# EAGLE design Button-Board (EAGLE 9.1.1)
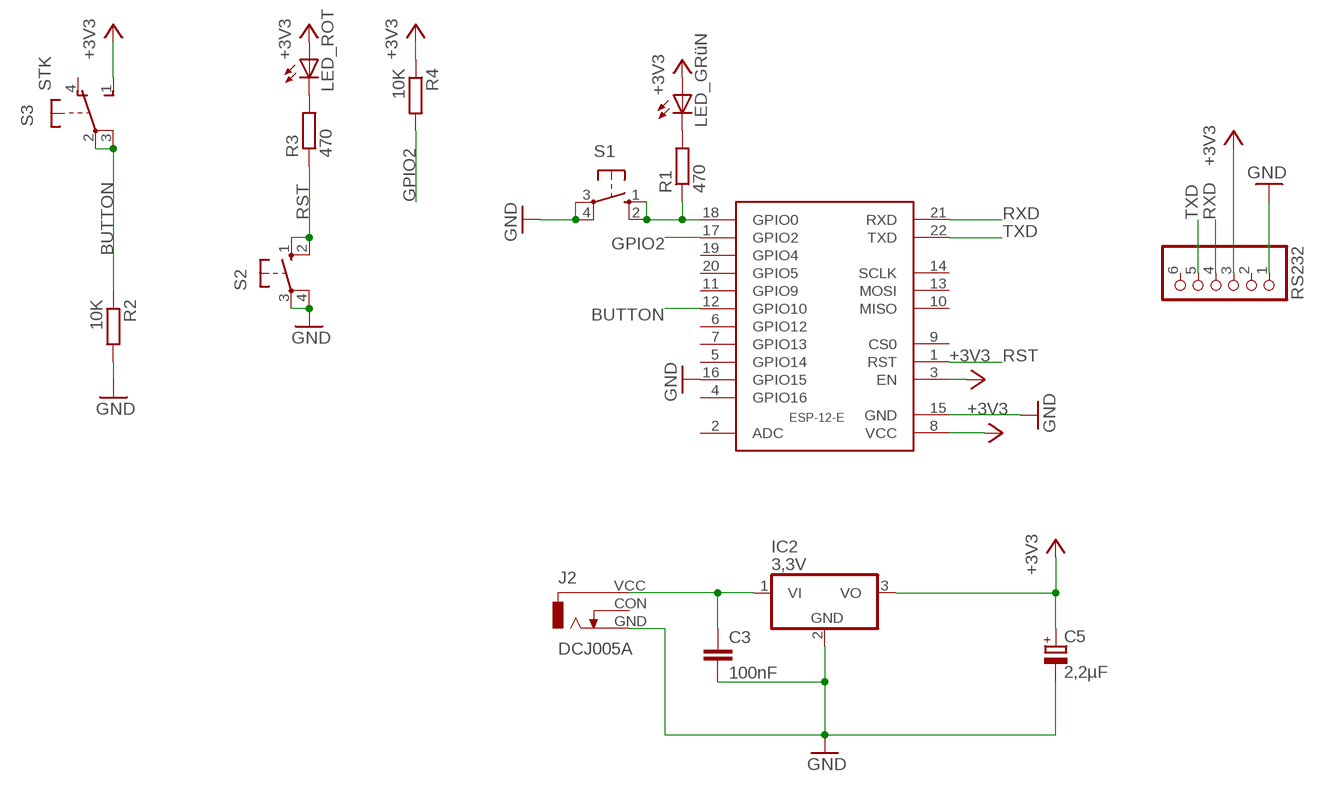
[diagram p0: schematic, sheet 1]

## Parts
C3  100nF  C-EU050-030X075  [C050-030X075]
C5  2,2µF  CPOL-EUE2.5-6  [E2,5-6]
IC2  3,3V  7805TV  [TO220V]
J2  DCJ005A  [DC005A]
LED_GRüN  LED5MM  [LED5MM]
LED_ROT  LED5MM  [LED5MM]
R1  470  R-EU_0207/10  [0207/10]
R2  10K  R-EU_0207/10  [0207/10]
R3  470  R-EU_0207/10  [0207/10]
R4  10K  R-EU_0207/10  [0207/10]
RS232  PINHD-1X6  [1X06]
S1  10-XX  [B3F-10XX]
S2  10-XX  [B3F-10XX]
S3  STK  [STK]
U$1  ESP-12-E  [ESP-12-E]

## Nets
+3V3 [supply]: C5.+ IC2.3(VO) LED_GRüN.A LED_ROT.A R4.1 RS232.3 S3.1(S) U$1.3(EN) U$1.8(VCC)
BUTTON: R2.1 S3.2(P) S3.3(P) U$1.12(GPIO10)
GND [supply]: C3.2 C5.- IC2.2(GND) J2.GND R2.2 RS232.1 S1.3(P) S1.4(P1) S2.3(P) S2.4(P1) U$1.15(GND) U$1.16(GPIO15)
GPIO2: R4.2 U$1.17(GPIO2)
N$1: R1.1 S1.1(S) S1.2(S1) U$1.18(GPIO0)
N$2: C3.1 IC2.1(VI) J2.VCC
N$3: LED_GRüN.K(C) R1.2
N$4: LED_ROT.K(C) R3.2
RST: R3.1 S2.1(S) S2.2(S1) U$1.1(RST)
RXD: RS232.4 U$1.21(RXD)
TXD: RS232.5 U$1.22(TXD)
Unconnected: J2.CON RS232.2 RS232.6 S3.4(O) U$1.2(ADC) U$1.4(GPIO16) U$1.5(GPIO14) U$1.6(GPIO12) U$1.7(GPIO13) U$1.9(CS0) U$1.10(MISO) U$1.11(GPIO9) U$1.13(MOSI) U$1.14(SCLK) U$1.19(GPIO4) U$1.20(GPIO5)

## Library data of the parts
C3 = rcl:C-EU: CAPACITOR, European symbol
C5 = rcl:CPOL-EU: POLARIZED CAPACITOR, European symbol
IC2 = linear:78*: Positive VOLTAGE REGULATOR Source: http://cache.national.com/ds/LM/LM78L05.pdf http://www.fairchildsemi.com/ds/LM/LM7805.pdf
J2 = !Häufige Bauteile:DCJ005A: DC POWER JACK Source: DCJ0202.pdf; OC_FARNELL: unknown; OC_NEWARK: unknown
LED_GRüN LED_ROT = !Häufige Bauteile:LED5MM
R1-R4 = rcl:R-EU_: RESISTOR, European symbol
RS232 = pinhead:PINHD-1X6: PIN HEADER
S1 S2 = switch-omron:10-XX: OMRON SWITCH; MPN: B3F-1000; OC_FARNELL: 176432; OC_NEWARK: 36M3542
S3 = switch-misc:STK: SWITCH
U$1 = !Eigene Library SMD:ESP-12-E

## Net classes
0 default: width 0.254 mm, clearance 0.254 mm
1 supply: width 0.508 mm, clearance 0.508 mm

## Board
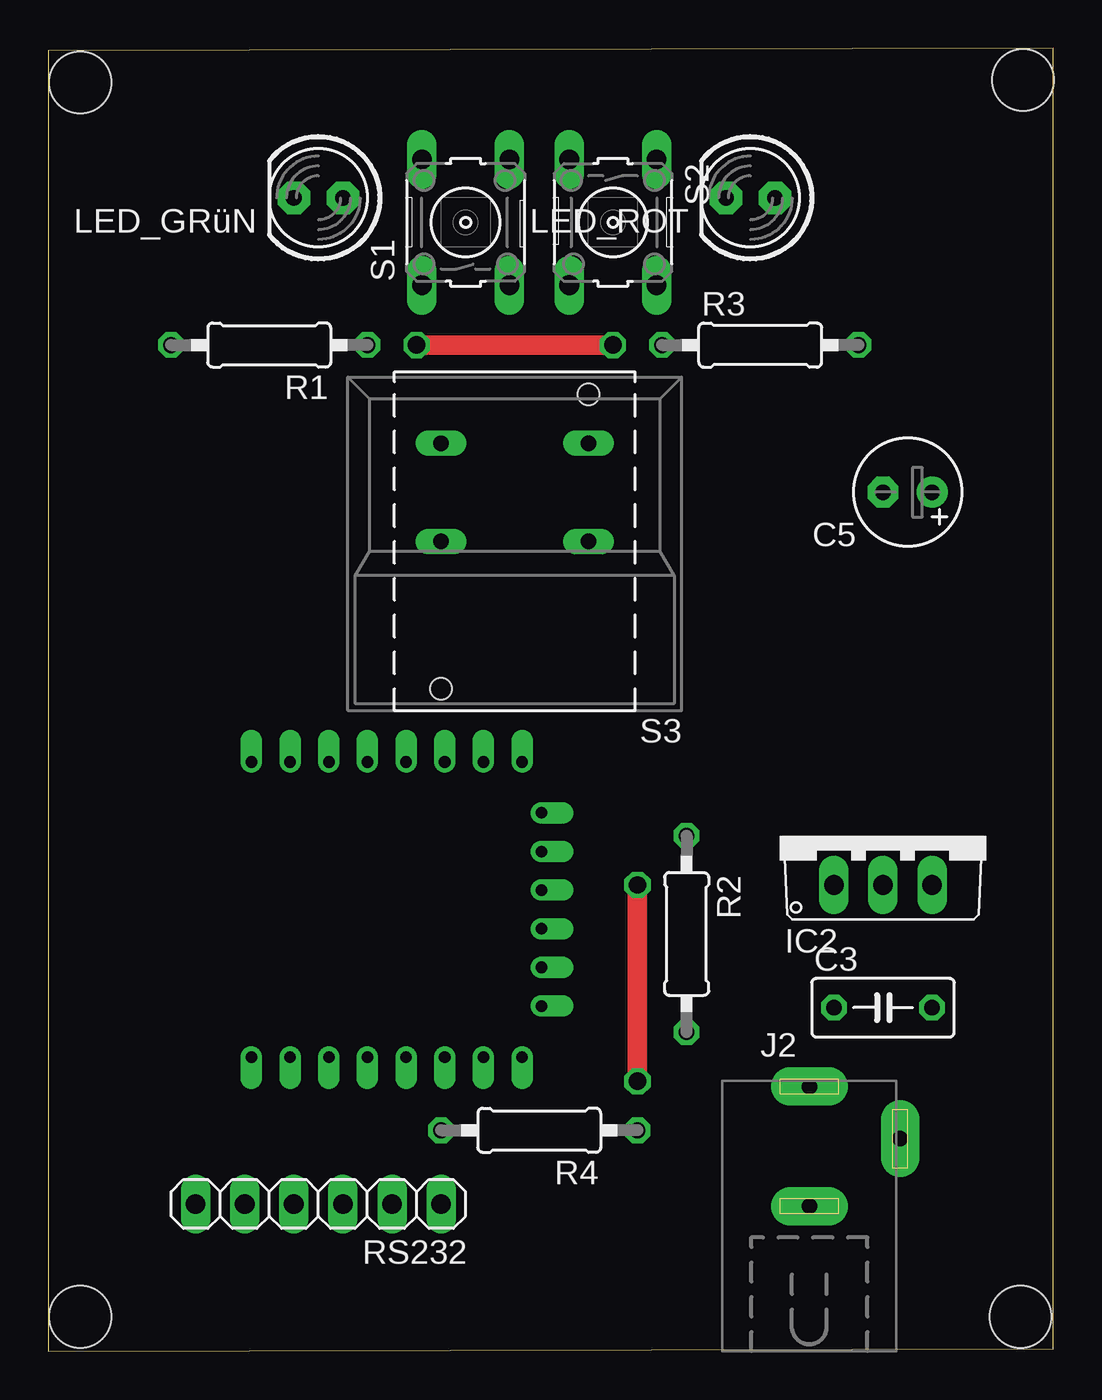
[diagram p1: board, top side]
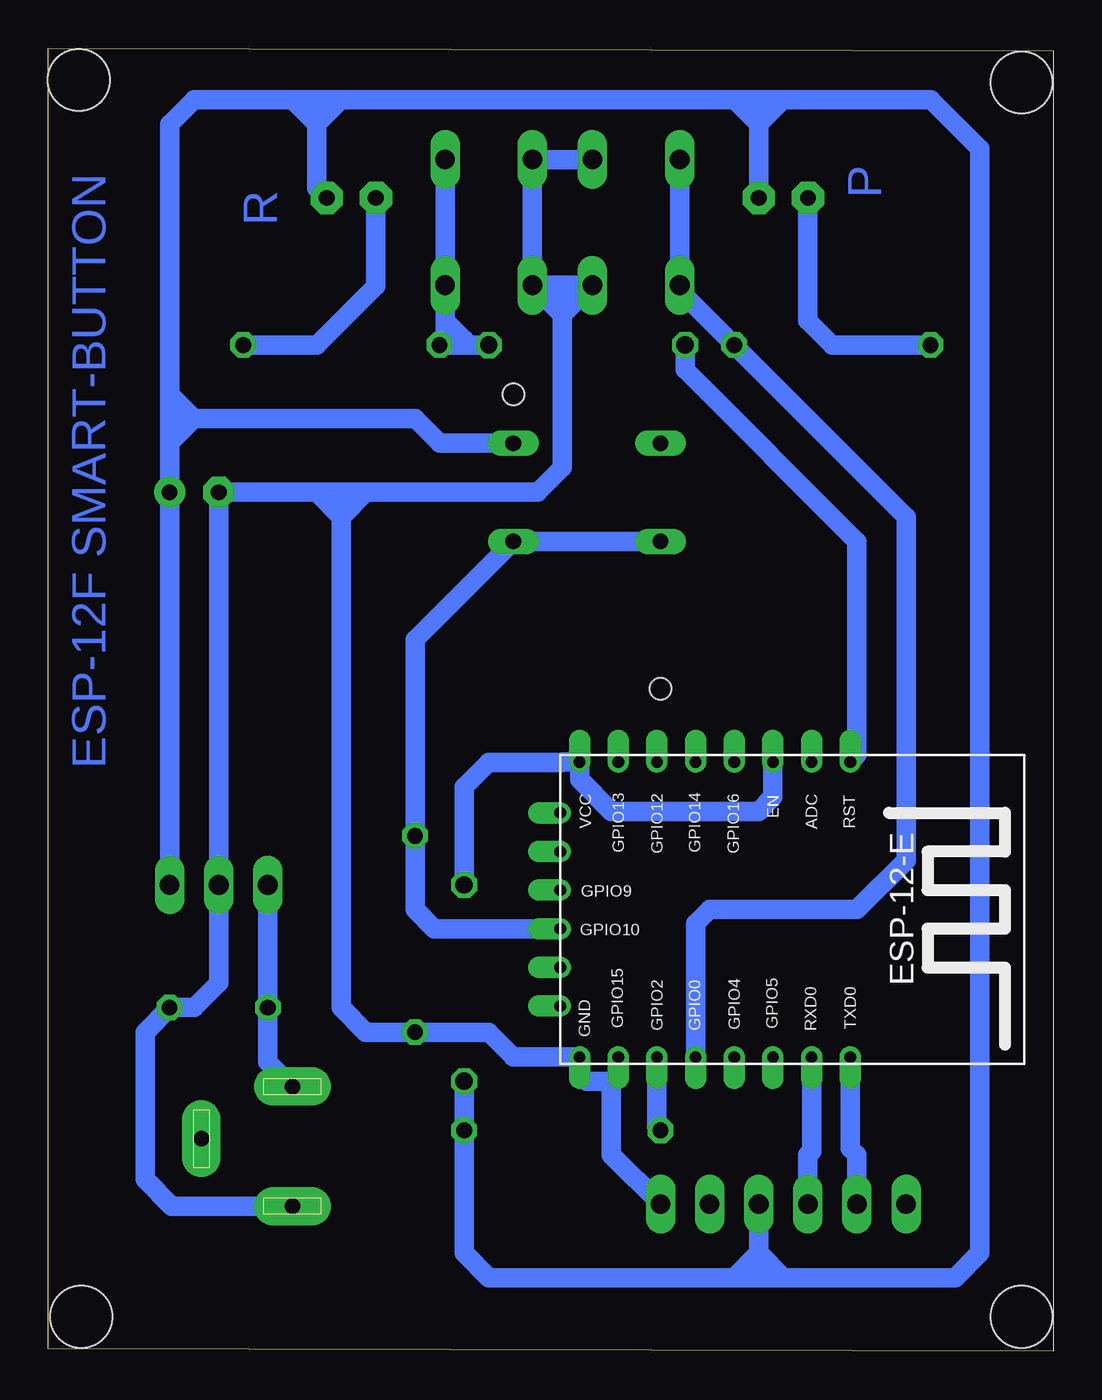
[diagram p2: board, bottom side, seen from below]

Size 51.99 x 67.43 mm. Coordinates in mm from the lower left corner, seen from the top.
Outline: 0,0 51.99,0.13 51.99,67.43 0,67.3 0,0
Copper layers (1*16): Top 0.035mm / dielectric 1.5mm / Bottom 0.035mm
Design rules "platinenbelichter": minimum track width 10mil, minimum drill 24mil, track to track 10mil, track to pad 10mil, pad to pad 10mil, via to via 10mil, smd to smd 10mil, copper to edge 40mil, drill to drill 8mil, minimum pad ring 10mil, minimum via ring 8mil, stop-mask expansion 10mil, vias tented up to drill 0mil, thermal gap 10mil
Holes 3.2 mm at 1.65,1.78 50.29,1.78 1.65,65.66 50.42,65.79

### Footprints (pad centres in the part's own frame; a part is rotated, then mirrored left to right if it is on the bottom)
C050-030X075 = drill 0.813 octagon: 1 -2.54,0; 2 2.54,0
E2,5-6 = drill 0.813 pad 1.6: + -1.27,0 | drill 0.813 pad 1.6 octagon: - 1.27,0
TO220V = drill 1.016 long: 1 -2.54,-2.54; 2 0,-2.54; 3 2.54,-2.54
DC005A = drill 0.8 pad 2 long: CON 4.7,4.65; GND 0,1.15; VCC 0,7.35
LED5MM = drill 0.813 pad 1.676 octagon: A -1.27,0; K 1.27,0
0207/10 = drill 0.813 octagon: 1 -5.08,0; 2 5.08,0
1X06 = drill 1.016 long: 1 -6.35,0; 2 -3.81,0; 3 -1.27,0; 4 1.27,0; 5 3.81,0; 6 6.35,0
B3F-10XX = drill 1.016 long: 1 -3.251,2.261; 2 3.251,2.261; 3 -3.251,-2.261; 4 3.251,-2.261
STK = drill 0.813 long: 1 -3.81,-5.08; 2 -3.81,0; 3 3.81,0; 4 3.81,-5.08 | hole 1.118: 3.81,7.62; -3.81,-7.62
ESP-12-E = drill 0.6 offset: 1 -7.635,6; 2 -7.635,4; 3 -7.635,2; 4 -7.635,0; 5 -7.635,-2; 6 -7.635,-4; 7 -7.635,-6; 8 -7.635,-8; 9 -5,-9; 10 -3,-9; 11 -1,-9; 12 1,-9; 13 3,-9; 14 5,-9; 15 7.635,-8; 16 7.635,-6; 17 7.635,-4; 18 7.635,-2; 19 7.635,0; 20 7.635,2; 21 7.635,4; 22 7.635,6

### Placement (x,y rotation side)
C3  43.18,17.78 0 top
C5  44.45,44.45 180 top
IC2  43.18,26.67 0 top
J2  39.37,6.35 0 top
LED_GRüN  13.97,59.69 180 top
LED_ROT  36.32,59.69 180 top
R1  11.43,52.07 180 top
R2  33.02,21.59 270 top
R3  36.83,52.07 0 top
R4  25.4,11.43 180 top
RS232  13.97,7.62 180 top
S1  21.59,58.42 90 top
S2  29.21,58.42 270 top
S3  24.13,41.91 180 top
U$1  16.51,22.86 270 bottom

### Tracks (layer width: path | path; a pad name or v marks a point on that pad's centre or on a via)
+3V3  (via drill 0.9)
  Top 1.016: v30.48,24.13 v30.48,13.97
  Bottom 1.016: U$1.3 14.51,28.67 15.24,27.94 22.86,27.94 24.51,29.59 U$1.8 25.39,30.5 25.4,30.48 29.21,30.48 30.48,29.21 v30.48,24.13 | IC2.3 C5.+ 45.72,46.99 | 45.72,46.99 45.72,48.26 | 38.1,64.77 36.83,64.77 | 36.83,64.77 16.51,64.77 | 16.51,64.77 15.24,64.77 | S3.1 31.75,46.99 33.02,48.26 44.45,48.26 | 44.45,48.26 45.72,48.26 | RS232.3 15.24,5.08 | 15.24,5.08 15.24,3.81 | 15.24,64.77 15.24,63.5 | 15.24,63.5 LED_GRüN.A | LED_ROT.A 38.1,60.2 38.1,63.5 | 38.1,63.5 38.1,64.77 | 45.72,48.26 45.72,49.53 | 45.72,49.53 45.72,63.5 44.45,64.77 39.37,64.77 | 39.37,64.77 38.1,64.77 | 15.24,64.77 13.97,64.77 | 13.97,64.77 6.35,64.77 3.81,62.23 3.81,5.08 5.08,3.81 13.97,3.81 | 13.97,3.81 15.24,3.81 | 15.24,3.81 16.51,3.81 | 16.51,3.81 29.21,3.81 30.48,5.08 R4.1 v30.48,13.97 | 45.72,49.53 44.45,48.26 | 44.45,48.26 45.72,46.99 | 39.37,64.77 38.1,63.5 | 38.1,63.5 36.83,64.77 | 16.51,64.77 15.24,63.5 | 15.24,63.5 13.97,64.77 | 15.24,5.08 16.51,3.81 | 15.24,5.08 13.97,3.81
BUTTON
  Bottom 1.016: S3.3 S3.2 33.02,36.83 R2.1 33.02,22.86 32.02,21.86 U$1.12
GND
  Bottom 1.016: 22.86,13.97 24.13,13.97 24.51,14.35 U$1.15 24.52,15.24 27.94,15.24 29.21,16.51 R2.2 35.56,16.51 36.83,17.78 36.83,43.18 | U$1.16 22.51,14.32 22.86,13.97 | RS232.1 22.86,10.16 22.86,13.97 | S2.4 S2.3 S1.4 | J2.GND 45.6,7.5 46.99,8.89 46.99,16.51 C3.2 44.45,17.78 43.18,19.05 IC2.2 C5.- 38.1,44.45 | S2.4 26.67,54.89 26.67,54.61 26.11,55.17 25.4,55.17 | S1.3 25.4,55.17 | 36.83,43.18 36.83,44.45 | 25.4,53.34 25.4,45.72 26.67,44.45 31.75,44.45 35.56,44.45 | 25.4,53.34 25.4,54.61 | 25.4,54.61 25.4,55.17 | 38.1,44.45 36.83,44.45 | 36.83,44.45 35.56,44.45 | 38.1,44.45 36.83,43.18 | 36.83,43.18 35.56,44.45 | S1.3 24.41,54.61 25.4,54.61 | S1.3 25.4,53.62 | 25.4,53.62 25.4,53.34 | S2.4 25.4,53.62 | 25.4,53.62 25.4,53.34
GPIO2
  Bottom 1.016: U$1.17 20.51,11.62 R4.2
N$1
  Bottom 1.016: S1.2 S1.1 19.33,55.03 19.05,54.61 R1.1 7.62,43.18 7.62,25.4 10.16,22.86 17.78,22.86 18.51,22.13 U$1.18
N$2
  Bottom 1.016: IC2.1 C3.1 40.64,14.97 J2.VCC
N$3
  Bottom 1.016: LED_GRüN.K 12.7,53.34 11.43,52.07 R1.2
N$4
  Bottom 1.016: LED_ROT.K 35.05,55.12 38.1,52.07 R3.2
RST  (via drill 0.9)
  Top 1.016: v29.21,52.07 v19.05,52.07
  Bottom 1.016: S2.1 S2.2 31.47,53.34 | 30.48,52.07 R3.1 31.47,52.35 31.47,53.34 | 30.48,52.07 v29.21,52.07 | U$1.1 10.16,30.84 10.16,41.91 19.05,50.8 v19.05,52.07 | 31.47,53.34 30.48,52.35 30.48,52.07
RXD
  Bottom 1.016: U$1.21 12.51,10.35 12.7,10.16 RS232.4
TXD
  Bottom 1.016: U$1.22 10.51,10.51 10.16,10.16 RS232.5

### Text on the board
Bottom: ESP-12F SMART-BUTTON | P | R